# Altium project Mfd3.PrjPcb
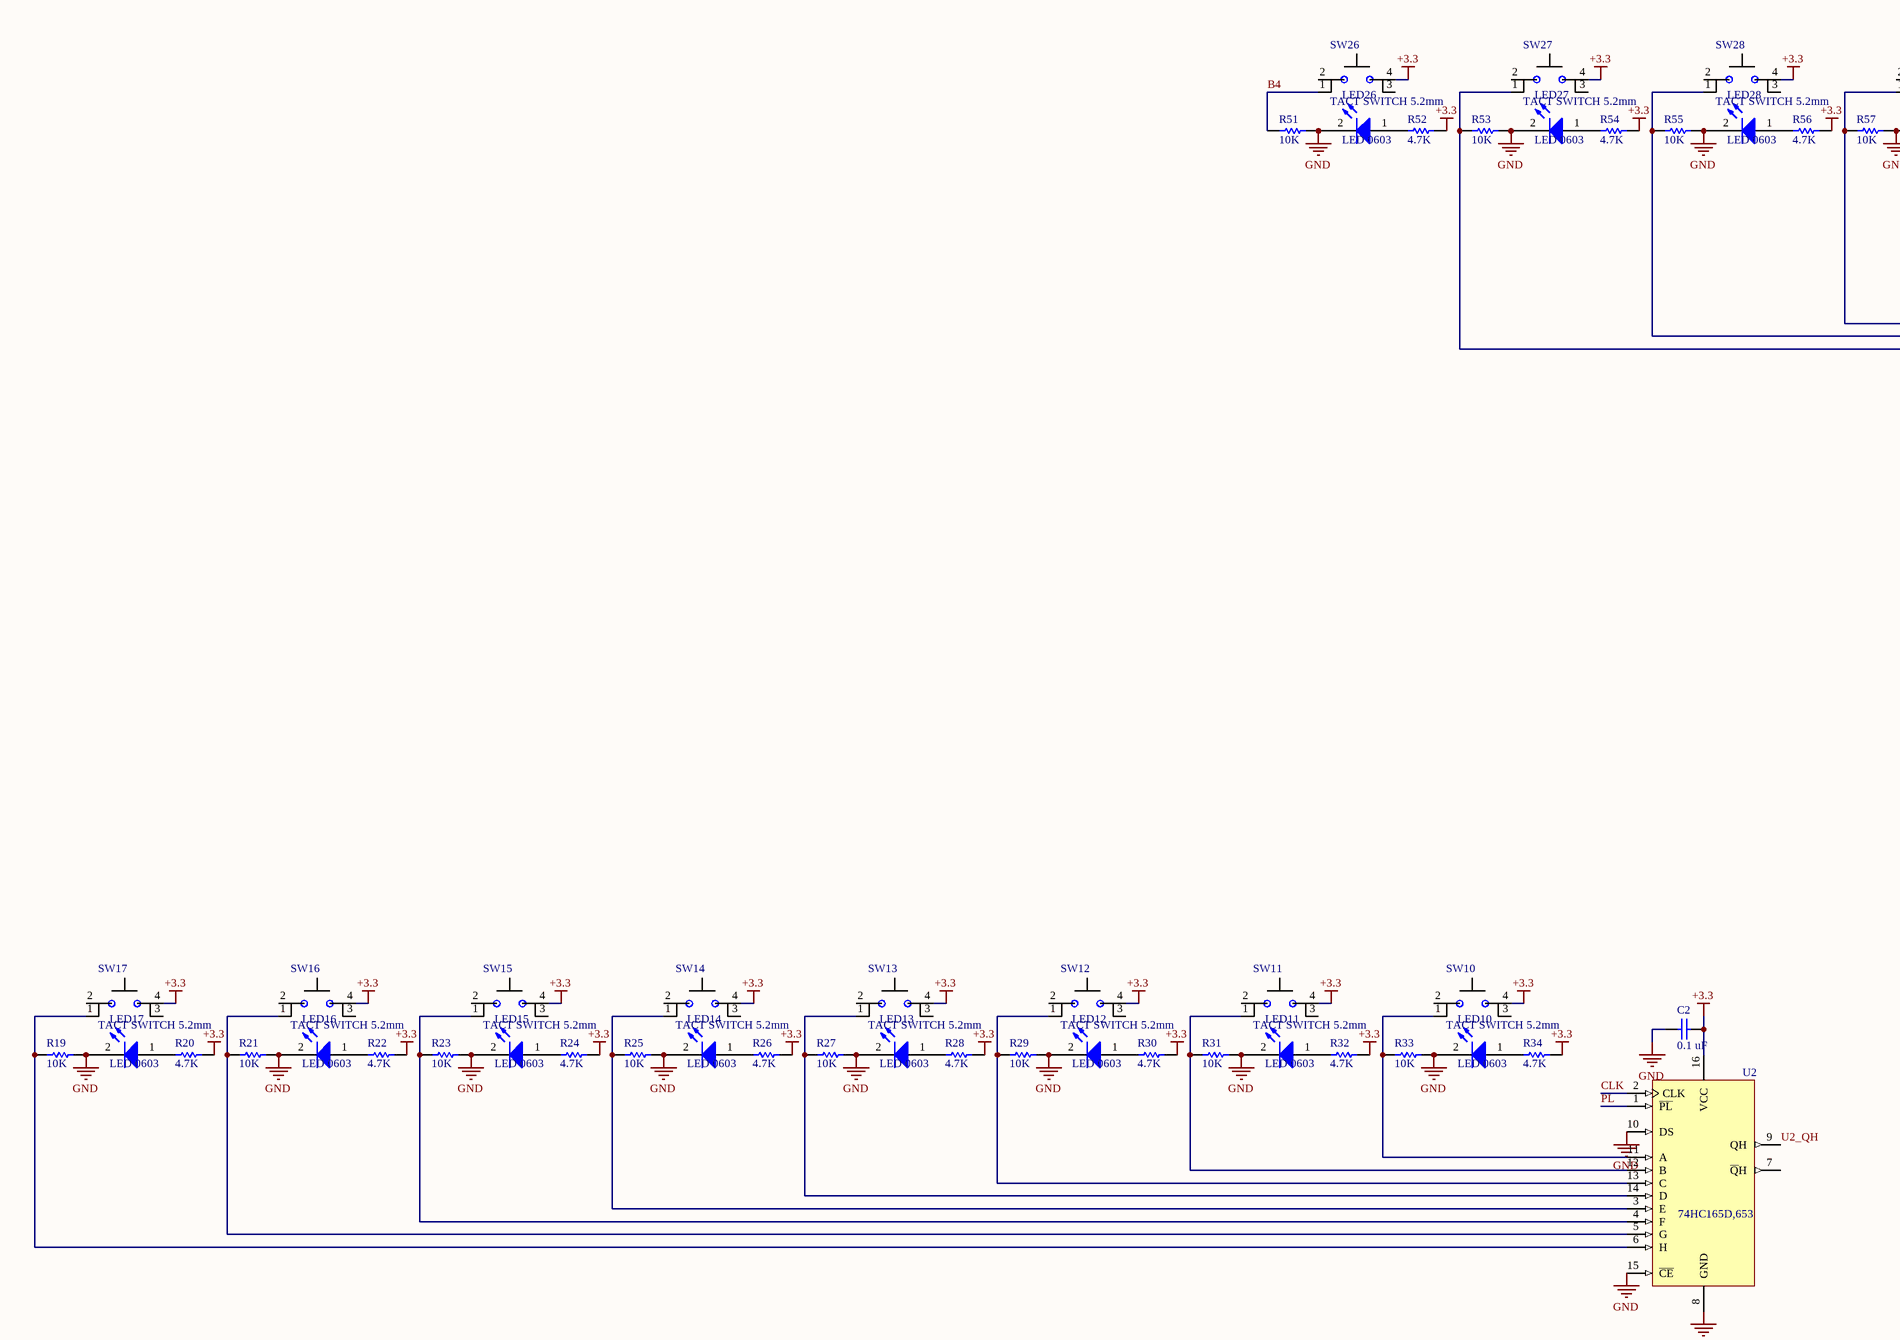
[diagram p0: Mfd3.SchDoc, top left]
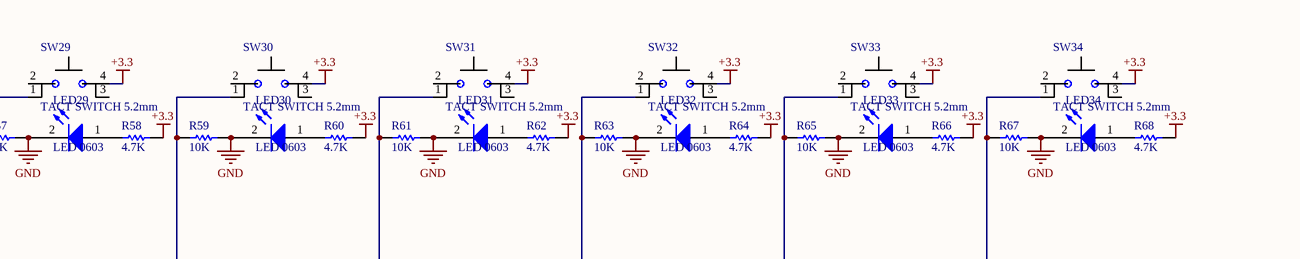
[diagram p1: Mfd3.SchDoc, top middle]
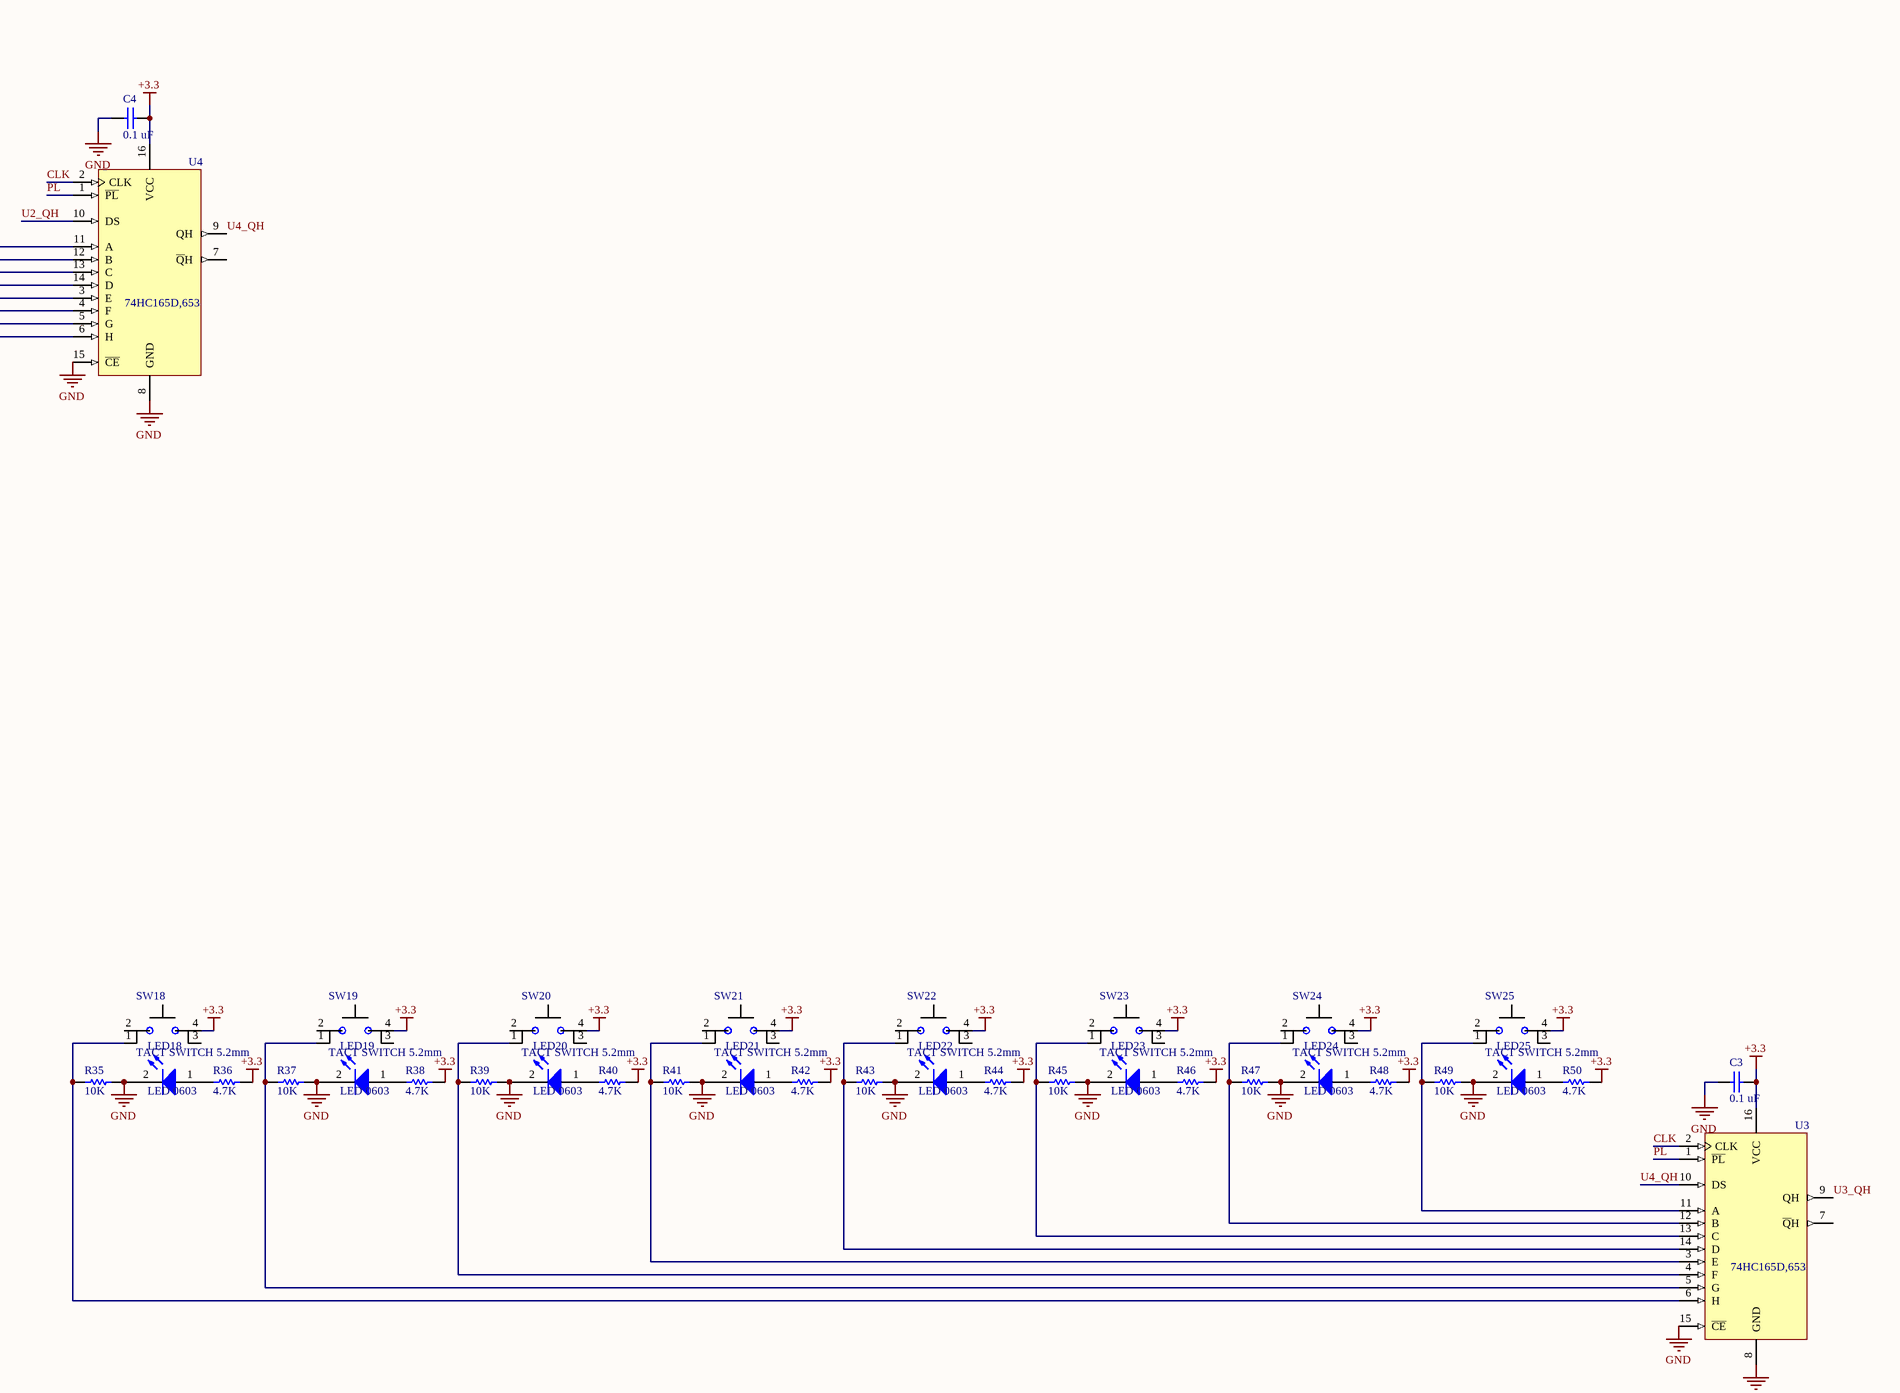
[diagram p2: Mfd3.SchDoc, top right]
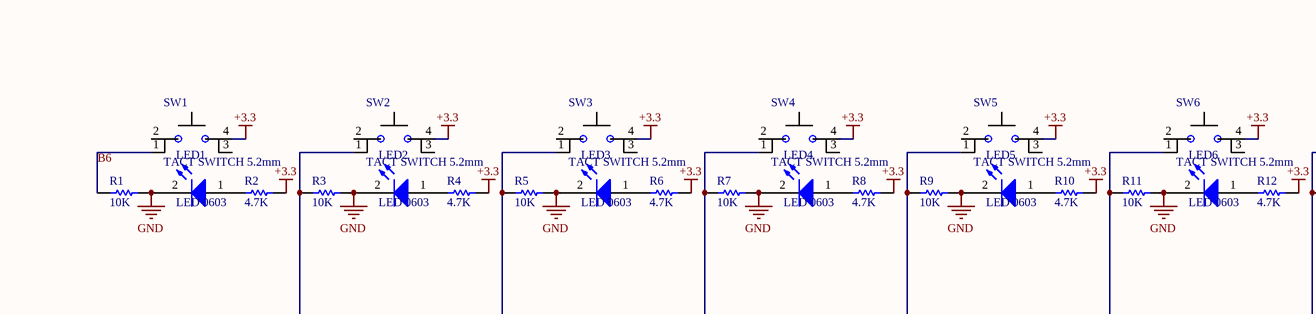
[diagram p3: Mfd3.SchDoc, bottom left]
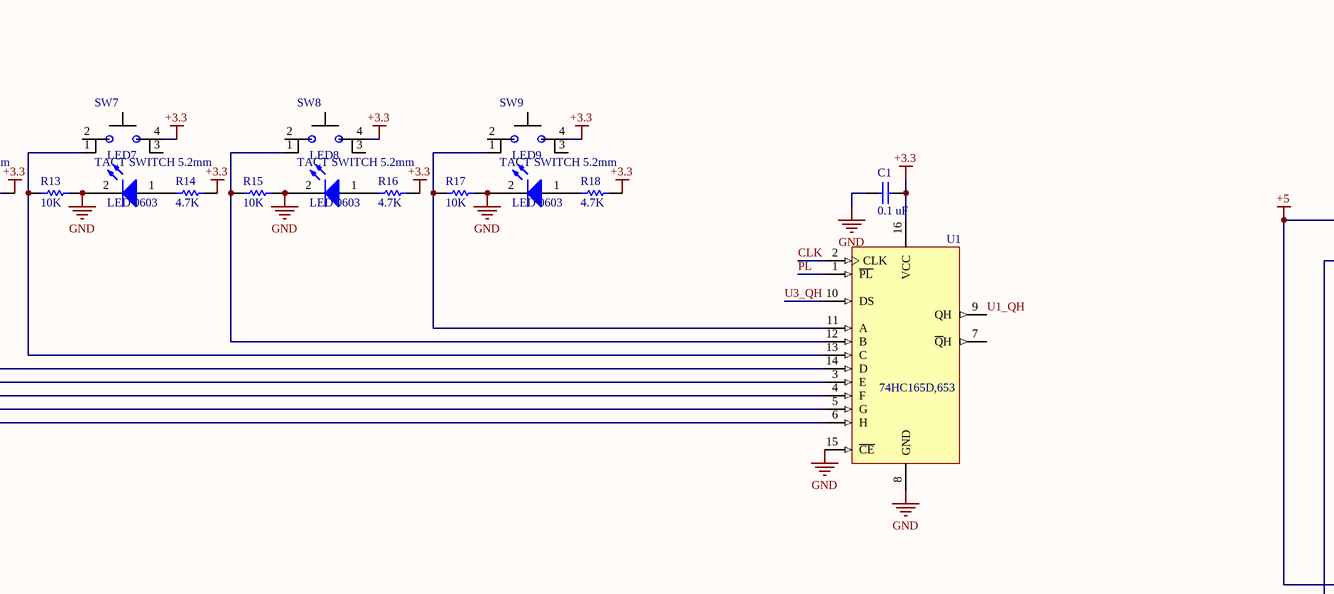
[diagram p4: Mfd3.SchDoc, bottom middle]
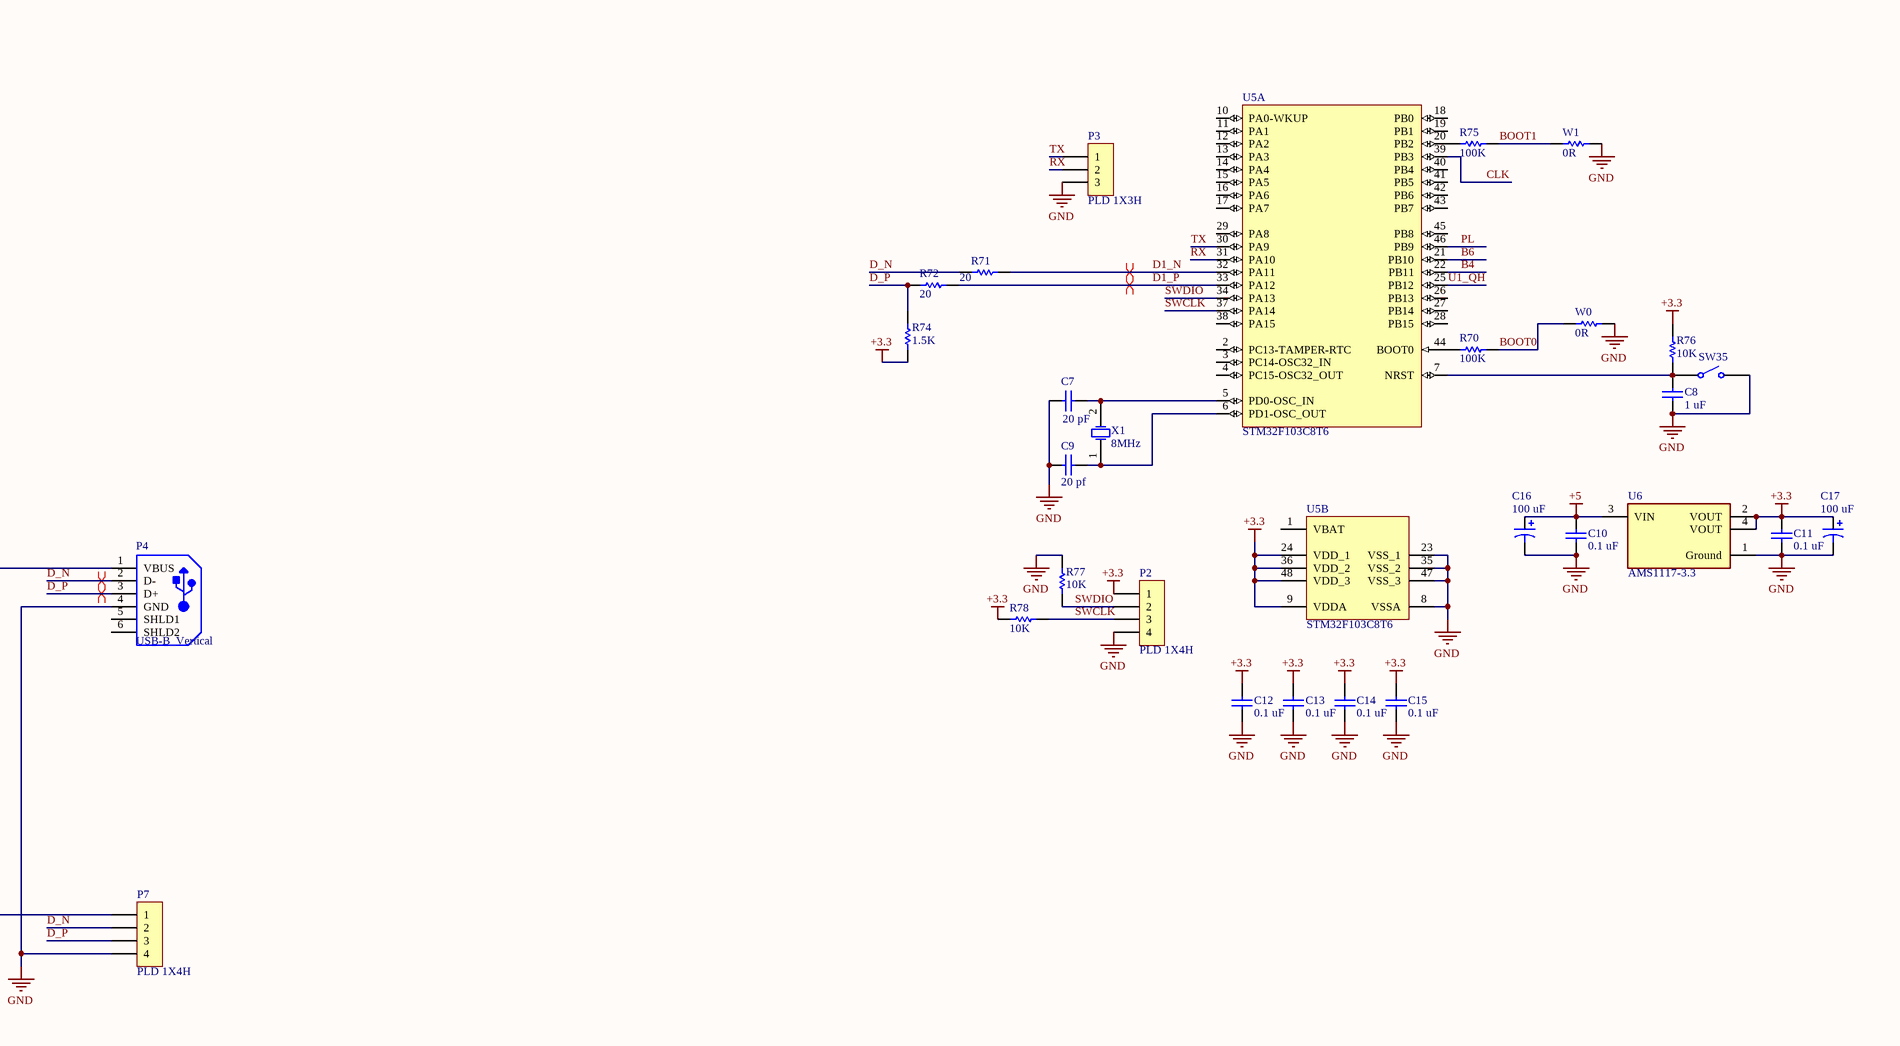
[diagram p5: Mfd3.SchDoc, bottom right]
1 sheet, 173 parts. Net scope: global (net labels, ports and power ports of the same name join across sheets).
Board file: Mfd3.PcbDoc

## Sheet Mfd3.SchDoc
size A0; Organization: Altium Limited; Address1: L3, 12a Rodborough Rd; Address2: Frenchs Forest; Address3: NSW; Address4: Australia 2086

### Parts
C1  0.1 uF  [1206-CAP]
C2  0.1 uF  [1206-CAP]
C3  0.1 uF  [1206-CAP]
C4  0.1 uF  [1206-CAP]
C7  20 pF  [0805 CAP]
C8  1 uF  [1206-CAP]
C9  20 pf  [0805 CAP]
C10  0.1 uF  [1206-CAP]
C11  0.1 uF  [1206-CAP]
C12  0.1 uF  [1206-CAP]
C13  0.1 uF  [1206-CAP]
C14  0.1 uF  [1206-CAP]
C15  0.1 uF  [1206-CAP]
C16  100 uF  [1210 Cap]
C17  100 uF  [1210 Cap]
LED1  LED 0603  [LED 0603]
LED2  LED 0603  [LED 0603]
LED3  LED 0603  [LED 0603]
LED4  LED 0603  [LED 0603]
LED5  LED 0603  [LED 0603]
LED6  LED 0603  [LED 0603]
LED7  LED 0603  [LED 0603]
LED8  LED 0603  [LED 0603]
LED9  LED 0603  [LED 0603]
LED10  LED 0603  [LED 0603]
LED11  LED 0603  [LED 0603]
LED12  LED 0603  [LED 0603]
LED13  LED 0603  [LED 0603]
LED14  LED 0603  [LED 0603]
LED15  LED 0603  [LED 0603]
LED16  LED 0603  [LED 0603]
LED17  LED 0603  [LED 0603]
LED18  LED 0603  [LED 0603]
LED19  LED 0603  [LED 0603]
LED20  LED 0603  [LED 0603]
LED21  LED 0603  [LED 0603]
LED22  LED 0603  [LED 0603]
LED23  LED 0603  [LED 0603]
LED24  LED 0603  [LED 0603]
LED25  LED 0603  [LED 0603]
LED26  LED 0603  [LED 0603]
LED27  LED 0603  [LED 0603]
LED28  LED 0603  [LED 0603]
LED29  LED 0603  [LED 0603]
LED30  LED 0603  [LED 0603]
LED31  LED 0603  [LED 0603]
LED32  LED 0603  [LED 0603]
LED33  LED 0603  [LED 0603]
LED34  LED 0603  [LED 0603]
P2  PLD 1X4H  [PLD 1X4H]
P3  PLD 1X3H  [PLD 1X3H]
P4  USB-B_Vertical  [USB-B_Vertical]
P7  PLD 1X4H  [PLD 1X4H]
R1  10K  [1206]
R2  4.7K  [1206]
R3  10K  [1206]
R4  4.7K  [1206]
R5  10K  [1206]
R6  4.7K  [1206]
R7  10K  [1206]
R8  4.7K  [1206]
R9  10K  [1206]
R10  4.7K  [1206]
R11  10K  [1206]
R12  4.7K  [1206]
R13  10K  [1206]
R14  4.7K  [1206]
R15  10K  [1206]
R16  4.7K  [1206]
R17  10K  [1206]
R18  4.7K  [1206]
R19  10K  [1206]
R20  4.7K  [1206]
R21  10K  [1206]
R22  4.7K  [1206]
R23  10K  [1206]
R24  4.7K  [1206]
R25  10K  [1206]
R26  4.7K  [1206]
R27  10K  [1206]
R28  4.7K  [1206]
R29  10K  [1206]
R30  4.7K  [1206]
R31  10K  [1206]
R32  4.7K  [1206]
R33  10K  [1206]
R34  4.7K  [1206]
R35  10K  [1206]
R36  4.7K  [1206]
R37  10K  [1206]
R38  4.7K  [1206]
R39  10K  [1206]
R40  4.7K  [1206]
R41  10K  [1206]
R42  4.7K  [1206]
R43  10K  [1206]
R44  4.7K  [1206]
R45  10K  [1206]
R46  4.7K  [1206]
R47  10K  [1206]
R48  4.7K  [1206]
R49  10K  [1206]
R50  4.7K  [1206]
R51  10K  [1206]
R52  4.7K  [1206]
R53  10K  [1206]
R54  4.7K  [1206]
R55  10K  [1206]
R56  4.7K  [1206]
R57  10K  [1206]
R58  4.7K  [1206]
R59  10K  [1206]
R60  4.7K  [1206]
R61  10K  [1206]
R62  4.7K  [1206]
R63  10K  [1206]
R64  4.7K  [1206]
R65  10K  [1206]
R66  4.7K  [1206]
R67  10K  [1206]
R68  4.7K  [1206]
R70  100K  [1206]
R71  20  [1206]
R72  20  [1206]
R74  1.5K  [0805 RES]
R75  100K  [1206]
R76  10K  [1206]
R77  10K  [1206]
R78  10K  [1206]
SW1  TACT SWITCH 5.2mm  [TACT SWITCH 5.2mm]
SW2  TACT SWITCH 5.2mm  [TACT SWITCH 5.2mm]
SW3  TACT SWITCH 5.2mm  [TACT SWITCH 5.2mm]
SW4  TACT SWITCH 5.2mm  [TACT SWITCH 5.2mm]
SW5  TACT SWITCH 5.2mm  [TACT SWITCH 5.2mm]
SW6  TACT SWITCH 5.2mm  [TACT SWITCH 5.2mm]
SW7  TACT SWITCH 5.2mm  [TACT SWITCH 5.2mm]
SW8  TACT SWITCH 5.2mm  [TACT SWITCH 5.2mm]
SW9  TACT SWITCH 5.2mm  [TACT SWITCH 5.2mm]
SW10  TACT SWITCH 5.2mm  [TACT SWITCH 5.2mm]
SW11  TACT SWITCH 5.2mm  [TACT SWITCH 5.2mm]
SW12  TACT SWITCH 5.2mm  [TACT SWITCH 5.2mm]
SW13  TACT SWITCH 5.2mm  [TACT SWITCH 5.2mm]
SW14  TACT SWITCH 5.2mm  [TACT SWITCH 5.2mm]
SW15  TACT SWITCH 5.2mm  [TACT SWITCH 5.2mm]
SW16  TACT SWITCH 5.2mm  [TACT SWITCH 5.2mm]
SW17  TACT SWITCH 5.2mm  [TACT SWITCH 5.2mm]
SW18  TACT SWITCH 5.2mm  [TACT SWITCH 5.2mm]
SW19  TACT SWITCH 5.2mm  [TACT SWITCH 5.2mm]
SW20  TACT SWITCH 5.2mm  [TACT SWITCH 5.2mm]
SW21  TACT SWITCH 5.2mm  [TACT SWITCH 5.2mm]
SW22  TACT SWITCH 5.2mm  [TACT SWITCH 5.2mm]
SW23  TACT SWITCH 5.2mm  [TACT SWITCH 5.2mm]
SW24  TACT SWITCH 5.2mm  [TACT SWITCH 5.2mm]
SW25  TACT SWITCH 5.2mm  [TACT SWITCH 5.2mm]
SW26  TACT SWITCH 5.2mm  [TACT SWITCH 5.2mm]
SW27  TACT SWITCH 5.2mm  [TACT SWITCH 5.2mm]
SW28  TACT SWITCH 5.2mm  [TACT SWITCH 5.2mm]
SW29  TACT SWITCH 5.2mm  [TACT SWITCH 5.2mm]
SW30  TACT SWITCH 5.2mm  [TACT SWITCH 5.2mm]
SW31  TACT SWITCH 5.2mm  [TACT SWITCH 5.2mm]
SW32  TACT SWITCH 5.2mm  [TACT SWITCH 5.2mm]
SW33  TACT SWITCH 5.2mm  [TACT SWITCH 5.2mm]
SW34  TACT SWITCH 5.2mm  [TACT SWITCH 5.2mm]
SW35  (no value)  [PushButton]
U1  74HC165D,653  [SOIC-16]
U2  74HC165D,653  [SOIC-16]
U3  74HC165D,653  [SOIC-16]
U4  74HC165D,653  [SOIC-16]
U5  STM32F103C8T6  [STM-LQFP48_N]  (parts A,B of 2)
U6  AMS1117-3.3  [FP-AMS1117-IPC_A]
W0  0R  [1206]
W1  0R  [1206]
X1  8MHz  [ABRA-ABM3-2_V]

### Nets
+3.3: C1.2 C2.2 C3.2 C4.2 C11.2 C12.2 C13.2 C14.2 C15.2 C17.1 P2.1 R2.2 R4.2 R6.2 R8.2 R10.2 R12.2 R14.2 R16.2 R18.2 R20.2 R22.2 R24.2 R26.2 R28.2 R30.2 R32.2 R34.2 R36.2 R38.2 R40.2 R42.2 R44.2 R46.2 R48.2 R50.2 R52.2 R54.2 R56.2 R58.2 R60.2 R62.2 R64.2 R66.2 R68.2 R74.1 R76.1 R78.2 SW1.4 SW2.4 SW3.4 SW4.4 SW5.4 SW6.4 SW7.4 SW8.4 SW9.4 SW10.4 SW11.4 SW12.4 SW13.4 SW14.4 SW15.4 SW16.4 SW17.4 SW18.4 SW19.4 SW20.4 SW21.4 SW22.4 SW23.4 SW24.4 SW25.4 SW26.4 SW27.4 SW28.4 SW29.4 SW30.4 SW31.4 SW32.4 SW33.4 SW34.4 U1.16(VCC) U2.16(VCC) U3.16(VCC) U4.16(VCC) U5.9(VDDA) U5.24(VDD_1) U5.36(VDD_2) U5.48(VDD_3) U6.2(VOUT) U6.4(VOUT)
+5: C10.2 C16.1 P4.1(VBUS) P7.1 U6.3(VIN)
GND: C1.1 C2.1 C3.1 C4.1 C7.2 C8.1 C9.2 C10.1 C11.1 C12.1 C13.1 C14.1 C15.1 C16.2 C17.2 LED1.2(K) LED2.2(K) LED3.2(K) LED4.2(K) LED5.2(K) LED6.2(K) LED7.2(K) LED8.2(K) LED9.2(K) LED10.2(K) LED11.2(K) LED12.2(K) LED13.2(K) LED14.2(K) LED15.2(K) LED16.2(K) LED17.2(K) LED18.2(K) LED19.2(K) LED20.2(K) LED21.2(K) LED22.2(K) LED23.2(K) LED24.2(K) LED25.2(K) LED26.2(K) LED27.2(K) LED28.2(K) LED29.2(K) LED30.2(K) LED31.2(K) LED32.2(K) LED33.2(K) LED34.2(K) P2.4 P3.3 P4.4(GND) P7.4 R1.1 R3.1 R5.1 R7.1 R9.1 R11.1 R13.1 R15.1 R17.1 R19.1 R21.1 R23.1 R25.1 R27.1 R29.1 R31.1 R33.1 R35.1 R37.1 R39.1 R41.1 R43.1 R45.1 R47.1 R49.1 R51.1 R53.1 R55.1 R57.1 R59.1 R61.1 R63.1 R65.1 R67.1 R77.1 SW35.2 U1.8(GND) U1.15(~{CE}) U2.8(GND) U2.10(DS) U2.15(~{CE}) U3.8(GND) U3.15(~{CE}) U4.8(GND) U4.15(~{CE}) U5.8(VSSA) U5.23(VSS_1) U5.35(VSS_2) U5.47(VSS_3) U6.1(Ground) W0.1 W1.1
B4: R51.2 SW26.1 U5.22(PB11)
B6: R1.2 SW1.1 U5.21(PB10)
BOOT0: R70.1 W0.2
BOOT1: R75.1 W1.2
CLK: U1.2(CLK) U2.2(CLK) U3.2(CLK) U4.2(CLK) U5.39(PB3)
D1_N: R71.2 U5.32(PA11)
D1_P: R72.2 U5.33(PA12)
D_N: P4.2(D-) P7.2 R71.1
D_P: P4.3(D+) P7.3 R72.1 R74.2
PL: U1.1(~{PL}) U2.1(~{PL}) U3.1(~{PL}) U4.1(~{PL}) U5.46(PB9)
RX: P3.2 U5.31(PA10)
SWCLK: P2.3 R78.1 U5.37(PA14)
SWDIO: P2.2 R77.2 U5.34(PA13)
TX: P3.1 U5.30(PA9)
U1_QH: U1.9(QH) U5.25(PB12)
U2_QH: U2.9(QH) U4.10(DS)
U3_QH: U1.10(DS) U3.9(QH)
U4_QH: U3.10(DS) U4.9(QH)
NetC7_1: C7.1 U5.5(PD0-OSC_IN) X1.2(X2)
NetC8_2: C8.2 R76.2 SW35.1 U5.7(NRST)
NetC9_1: C9.1 U5.6(PD1-OSC_OUT) X1.1(X1)
NetLED1_1: LED1.1(A) R2.1
NetLED2_1: LED2.1(A) R4.1
NetLED3_1: LED3.1(A) R6.1
NetLED4_1: LED4.1(A) R8.1
NetLED5_1: LED5.1(A) R10.1
NetLED6_1: LED6.1(A) R12.1
NetLED7_1: LED7.1(A) R14.1
NetLED8_1: LED8.1(A) R16.1
NetLED9_1: LED9.1(A) R18.1
NetLED10_1: LED10.1(A) R34.1
NetLED11_1: LED11.1(A) R32.1
NetLED12_1: LED12.1(A) R30.1
NetLED13_1: LED13.1(A) R28.1
NetLED14_1: LED14.1(A) R26.1
NetLED15_1: LED15.1(A) R24.1
NetLED16_1: LED16.1(A) R22.1
NetLED17_1: LED17.1(A) R20.1
NetLED18_1: LED18.1(A) R36.1
NetLED19_1: LED19.1(A) R38.1
NetLED20_1: LED20.1(A) R40.1
NetLED21_1: LED21.1(A) R42.1
NetLED22_1: LED22.1(A) R44.1
NetLED23_1: LED23.1(A) R46.1
NetLED24_1: LED24.1(A) R48.1
NetLED25_1: LED25.1(A) R50.1
NetLED26_1: LED26.1(A) R52.1
NetLED27_1: LED27.1(A) R54.1
NetLED28_1: LED28.1(A) R56.1
NetLED29_1: LED29.1(A) R58.1
NetLED30_1: LED30.1(A) R60.1
NetLED31_1: LED31.1(A) R62.1
NetLED32_1: LED32.1(A) R64.1
NetLED33_1: LED33.1(A) R66.1
NetLED34_1: LED34.1(A) R68.1
NetR3_2: R3.2 SW2.1 U1.6(H)
NetR5_2: R5.2 SW3.1 U1.5(G)
NetR7_2: R7.2 SW4.1 U1.4(F)
NetR9_2: R9.2 SW5.1 U1.3(E)
NetR11_2: R11.2 SW6.1 U1.14(D)
NetR13_2: R13.2 SW7.1 U1.13(C)
NetR15_2: R15.2 SW8.1 U1.12(B)
NetR17_2: R17.2 SW9.1 U1.11(A)
NetR19_2: R19.2 SW17.1 U2.6(H)
NetR21_2: R21.2 SW16.1 U2.5(G)
NetR23_2: R23.2 SW15.1 U2.4(F)
NetR25_2: R25.2 SW14.1 U2.3(E)
NetR27_2: R27.2 SW13.1 U2.14(D)
NetR29_2: R29.2 SW12.1 U2.13(C)
NetR31_2: R31.2 SW11.1 U2.12(B)
NetR33_2: R33.2 SW10.1 U2.11(A)
NetR35_2: R35.2 SW18.1 U3.6(H)
NetR37_2: R37.2 SW19.1 U3.5(G)
NetR39_2: R39.2 SW20.1 U3.4(F)
NetR41_2: R41.2 SW21.1 U3.3(E)
NetR43_2: R43.2 SW22.1 U3.14(D)
NetR45_2: R45.2 SW23.1 U3.13(C)
NetR47_2: R47.2 SW24.1 U3.12(B)
NetR49_2: R49.2 SW25.1 U3.11(A)
NetR53_2: R53.2 SW27.1 U4.6(H)
NetR55_2: R55.2 SW28.1 U4.5(G)
NetR57_2: R57.2 SW29.1 U4.4(F)
NetR59_2: R59.2 SW30.1 U4.3(E)
NetR61_2: R61.2 SW31.1 U4.14(D)
NetR63_2: R63.2 SW32.1 U4.13(C)
NetR65_2: R65.2 SW33.1 U4.12(B)
NetR67_2: R67.2 SW34.1 U4.11(A)
NetR70_2: R70.2 U5.44(BOOT0)
NetR75_2: R75.2 U5.20(PB2)

Not connected (* = marked no-connect by the designer): P4 5(SHLD1) 6(SHLD2); SW1 2 3(34); SW2 2 3(34); SW3 2 3(34); SW4 2 3(34); SW5 2 3(34); SW6 2 3(34); SW7 2 3(34); SW8 2 3(34); SW9 2 3(34); SW10 2 3(34); SW11 2 3(34); SW12 2 3(34); SW13 2 3(34); SW14 2 3(34); SW15 2 3(34); SW16 2 3(34); SW17 2 3(34); SW18 2 3(34); SW19 2 3(34); SW20 2 3(34); SW21 2 3(34); SW22 2 3(34); SW23 2 3(34); SW24 2 3(34); SW25 2 3(34); SW26 2 3(34); SW27 2 3(34); SW28 2 3(34); SW29 2 3(34); SW30 2 3(34); SW31 2 3(34); SW32 2 3(34); SW33 2 3(34); SW34 2 3(34); U1 7(~{Q}H); U2 7(~{Q}H); U3 7(~{Q}H); U4 7(~{Q}H); U5 1(VBAT) 2(PC13-TAMPER-RTC) 3(PC14-OSC32_IN) 4(PC15-OSC32_OUT) 10(PA0-WKUP) 11(PA1) 12(PA2) 13(PA3) 14(PA4) 15(PA5) 16(PA6) 17(PA7) 18(PB0) 19(PB1) 26(PB13) 27(PB14) 28(PB15) 29(PA8) 38(PA15) 40(PB4) 41(PB5) 42(PB6) 43(PB7) 45(PB8)

### Layout directives
differential pair: D1_N, D1_P, D_N, D_P

### Notes on the sheet
- Title
- Size:
- Date:
- File:
- A0
- Number:
- Time:
- Revision:
- Sheet
- of

### Library data of the parts
C1-C4 C7-C15 = Capacitor: Chip Capacitor, 1206
  C1-C4 C10-C15: LCSC Part #: C24497
  C7 C9: LCSC Part #: C1798
  C8: LCSC Part #: C1848
C16 C17 = Capacitor Tantalum: Tantalum Capacitor, 1210; LCSC Part #: C16133
P2 P7 = PLD 1X4H: Header, 4-Pin, SIngle row, Right Angle
P3 = PLD 1X3H: Header, 3-Pin, SIngle row, Right Angle
R1-R68 R70-R72 R75-R78 W0 W1 = Resistor: Resistor 1206
  R1 R3 R5 R7 R9 R11 R13 R15 R17 R19 R21 R23 R25 R27 R29 R31 R33 R35 R37 R39 R41 R43 R45 R47 R49 R51 R53 R55 R57 R59 R61 R63 R65 R67 R76-R78: LCSC Part #: C17902
  R2 R4 R6 R8 R10 R12 R14 R16 R18 R20 R22 R24 R26 R28 R30 R32 R34 R36 R38 R40 R42 R44 R46 R48 R50 R52 R54 R56 R58 R60 R62 R64 R66 R68: LCSC Part #: C17936
  R70 R75: LCSC Part #: C17900
  R71 R72: LCSC Part #: C17955
  W0 W1: LCSC Part #: C17888
R74 = Resistor1: Resistor 0805; LCSC Part #: C4310
SW1-SW34 = TACT SWITCH 5.2mm: Push button 5.2 mm; LCSC Part #: C412369
SW35 = Pushbutton: WS-TASV SMD Tact Switch 6.0X3.5 mm; PartNumber: 434121050816; Manufacturer: Wuerth Elektronik; NoPins: 02; ComponentLink1Description: Manufacturer URL; PackageReference: 434121050816; ComponentLink2URL: http://katalog.we-online.de/em/datasheet/434121050816.pdf; ComponentLink1URL: http://www.we-online.com; ComponentLink2Description: Datasheet
U1-U4 = 74HC165: 8-Bit Parallel-Load Shift Registers, SOIC-16, LARGE T&R; LCSC Part #: C5613
U5 = STM32F103C8T6: ARM Cortex-M3 32-bit MCU, 64 KB Flash, 20 KB Internal RAM, 37 I/Os, 48-pin LQFP, -40 to 85 degC, Tray; LCSC Part #: C8734
U6 = AMS1117-3.3: LDO Voltage Regulators 1A, 3.3V; ComponentLink2Description: Datasheet; ComponentLink2URL: http://www.advanced-monolithic.com/pdf/ds1117.pdf; LCSC Part #: C6186
X1 = 8MHz: Miniature Ceramic Crystal, 8 MHz, -40 to 85 degC, 2-Pin SMD, RoHS, Tape and Reel; LCSC Part #: C115962
LED1-LED34 = LED 0603: LCSC Part #: C72043